# Altium schematic sheet Doorsensor_433MHz.SchDoc
size A4; SheetNumber: 1; SheetTotal: 1
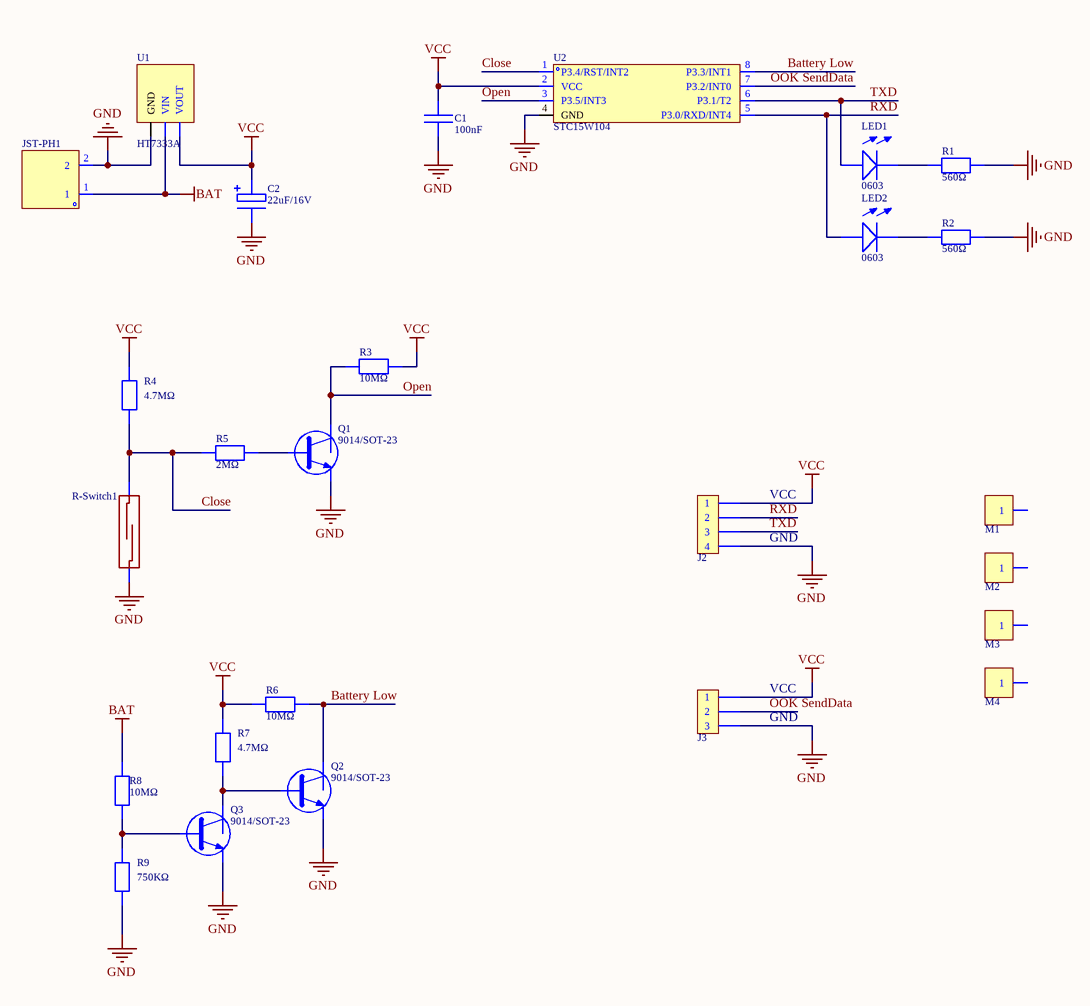
[diagram p0: Doorsensor_433MHz.SchDoc]

## Parts
C1  100nF  [C0603]
C2  22uF/16V  [C(Electrolytic)_SMD-D4.0mm_L5.4mm]
J2  PinHeader_4Pin  [PinHeader_4Pin-2.54mm]  (value not drawn)
J3  PinHeader_3Pin  [PinSocket_3Pin-2.54mm]  (value not drawn)
JST-PH1  JST-PH2.0_2Pin-TH-Vertical  [Connector-JST-PH2.0-2Pin_TH-Vertical]  (value not drawn)
LED1  0603  [LED0603-Castellated]
LED2  0603  [LED0603-Castellated]
M1  PCB Mounting Hole  [PCB Mounting Hole]  (value not drawn)
M2  PCB Mounting Hole  [PCB Mounting Hole]  (value not drawn)
M3  PCB Mounting Hole  [PCB Mounting Hole]  (value not drawn)
M4  PCB Mounting Hole  [PCB Mounting Hole]  (value not drawn)
Q1  9014/SOT-23  [SOT-23-3]
Q2  9014/SOT-23  [SOT-23-3]
Q3  9014/SOT-23  [SOT-23-3]
R1  560Ω  [R0603]
R2  560Ω  [R0603]
R3  10MΩ  [R0603]
R4  4.7MΩ  [R0603]
R5  2MΩ  [R0603]
R6  10MΩ  [R0603]
R7  4.7MΩ  [R0603]
R8  10MΩ  [R0603]
R9  750KΩ  [R0603]
R-Switch1  CT10-G1  [Reed Switch_Molded-SMD_SPST]  (value not drawn)
U1  HT7333A  [SOT89-3]
U2  STC15W104  [SOIC_8Pin-L5.0-W4.0]

## Nets
BAT: JST-PH1.1 R8.2 U1.2(VIN)
GND: C1.1 C2.2 J2.4 J3.3 JST-PH1.2 Q1.2 Q2.2 Q3.2 R1.2 R2.2 R9.1 R-Switch1.1 U1.1(GND) U2.4(GND)
VCC: C1.2 C2.1 J2.1 J3.1 R3.2 R4.2 R6.1 R7.2 U1.3(VOUT) U2.2(VCC)
Battery Low: Q2.3 R6.2 U2.8(P3.3/INT1)
Close: R4.1 R5.1 R-Switch1.2 U2.1(P3.4/RST/INT2)
OOK SendData: J3.2 U2.7(P3.2/INT0)
Open: Q1.3 R3.1 U2.3(P3.5/INT3)
RXD: J2.2 LED2.1 U2.5(P3.0/RXD/INT4)
TXD: J2.3 LED1.1 U2.6(P3.1/T2)
NetLED1_2: LED1.2 R1.1
NetLED2_2: LED2.2 R2.1
NetQ1_1: Q1.1 R5.2
NetQ2_1: Q2.1 Q3.3 R7.1
NetQ3_1: Q3.1 R8.1 R9.2

Not connected (* = marked no-connect by the designer): M1 1; M2 1; M3 1; M4 1

## Notes on the sheet
- (near J2) VCC
- (near J2) GND
- (near J3) VCC
- (near J3) GND

## Library data of the parts
C1 = Capacitor_0603: Value: 100nF
C2 = Capacitor_Electrolytic-SMD-D4.0xL5.4mm: Value: 22uF/16V
J2 = PinHeader_4Pin: Straight Single Row, Square Pitch, 2.54mm
J3 = PinHeader_3Pin: Straight Single Row, Square Pitch, 2.54mm
LED1 LED2 = LED_0603: Value: 0603
M1-M4 = PCB Mounting Hole: Mounting Hole
Q1-Q3 = NPN_SOT-23-3: Value: 9014/SOT-23
R1 R2 R4 R5 R7 R9 = Resistor_0603: Value: 10MΩ
R3 R6 R8 = Resistor_0603: Value: 10MΩ
R-Switch1 = Reed-Switch_Molded-SMD: Value: CT10-G1
U1 = LDO_SOT89-3: Value: HT7333A
U2 = STC15W104_SOP8: Value: STC15W104